# EAGLE design Tindog (EAGLE 5.11)
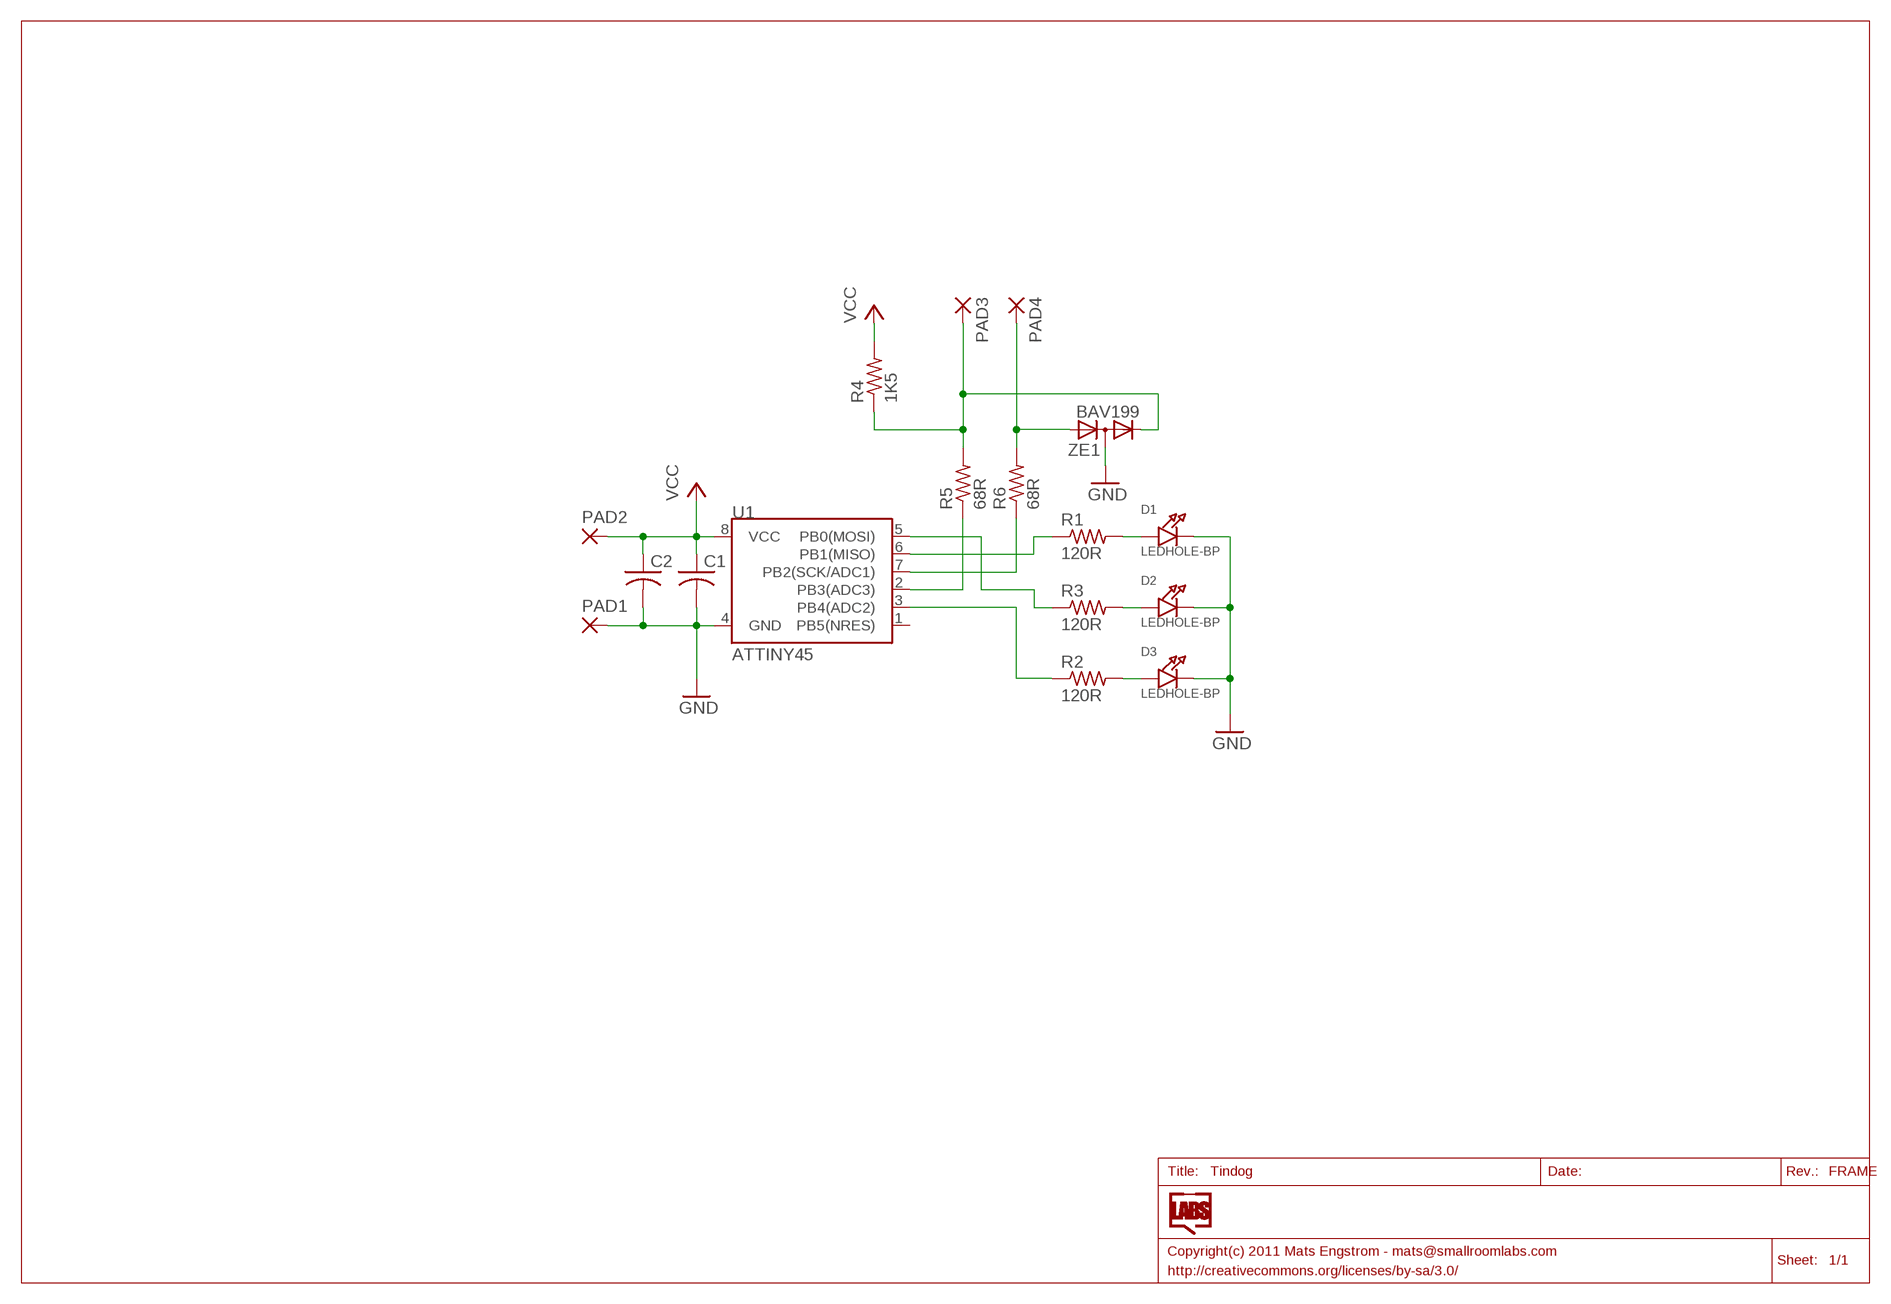
[diagram p0: schematic, sheet 1]

## Parts
C1  C-USC1206K  [C1206K]
C2  C-USC1206K  [C1206K]
D1  LEDHOLE-BP  [LED3MM-HOLE-BACKPAD]
D2  LEDHOLE-BP  [LED3MM-HOLE-BACKPAD]
D3  LEDHOLE-BP  [LED3MM-HOLE-BACKPAD]
PAD1  SMD5  [SMD2,54-5,08]
PAD2  SMD5  [SMD2,54-5,08]
PAD3  SMD5  [SMD2,54-5,08]
PAD4  SMD5  [SMD2,54-5,08]
R1  120R  R-US_R1206W  [R1206W]
R2  120R  R-US_R1206W  [R1206W]
R3  120R  R-US_R1206W  [R1206W]
R4  1K5  R-US_R1206W  [R1206W]
R5  68R  R-US_R1206W  [R1206W]
R6  68R  R-US_R1206W  [R1206W]
U1  ATTINY45  [SO08-EIAJ]
ZE1  BAV199  [SOT23]

## Nets
D+: PAD4.1(P) R6.2 ZE1.1(A)
D-: PAD3.1(P) R4.1 R5.2 ZE1.2(C)
GND: C1.2 C2.2 D1.C D2.C D3.C PAD1.1(P) U1.4(GND) ZE1.3(AC)
N$1: R3.1 U1.5(PB0(MOSI))
N$2: R1.1 U1.6(PB1(MISO))
N$3: D1.A R1.2
N$4: D2.A R3.2
N$5: D3.A R2.2
N$7: R2.1 U1.3(PB4(ADC2))
N$8: R5.1 U1.2(PB3(ADC3))
N$9: R6.1 U1.7(PB2(SCK/ADC1))
VCC: C1.1 C2.1 PAD2.1(P) R4.2 U1.8(VCC)
Unconnected: U1.1(PB5(NRES))

## Library data of the parts
C1 C2 = adafruit:C-US: CAPACITOR, American symbol
D1-D3 = SmallRoomLabs:LED
PAD1-PAD4 = wirepad:SMD5: SMD PAD
R1-R6 = adafruit:R-US_: RESISTOR, American symbol
U1 = SparkFun:ATTINY45: Atmel ATTiny45
ZE1 = diode:BAV199: DIODE low-leakage double diode

## Net classes
0 default: width 0.203 mm, drill 0.305 mm, clearance 0.203 mm

## Board
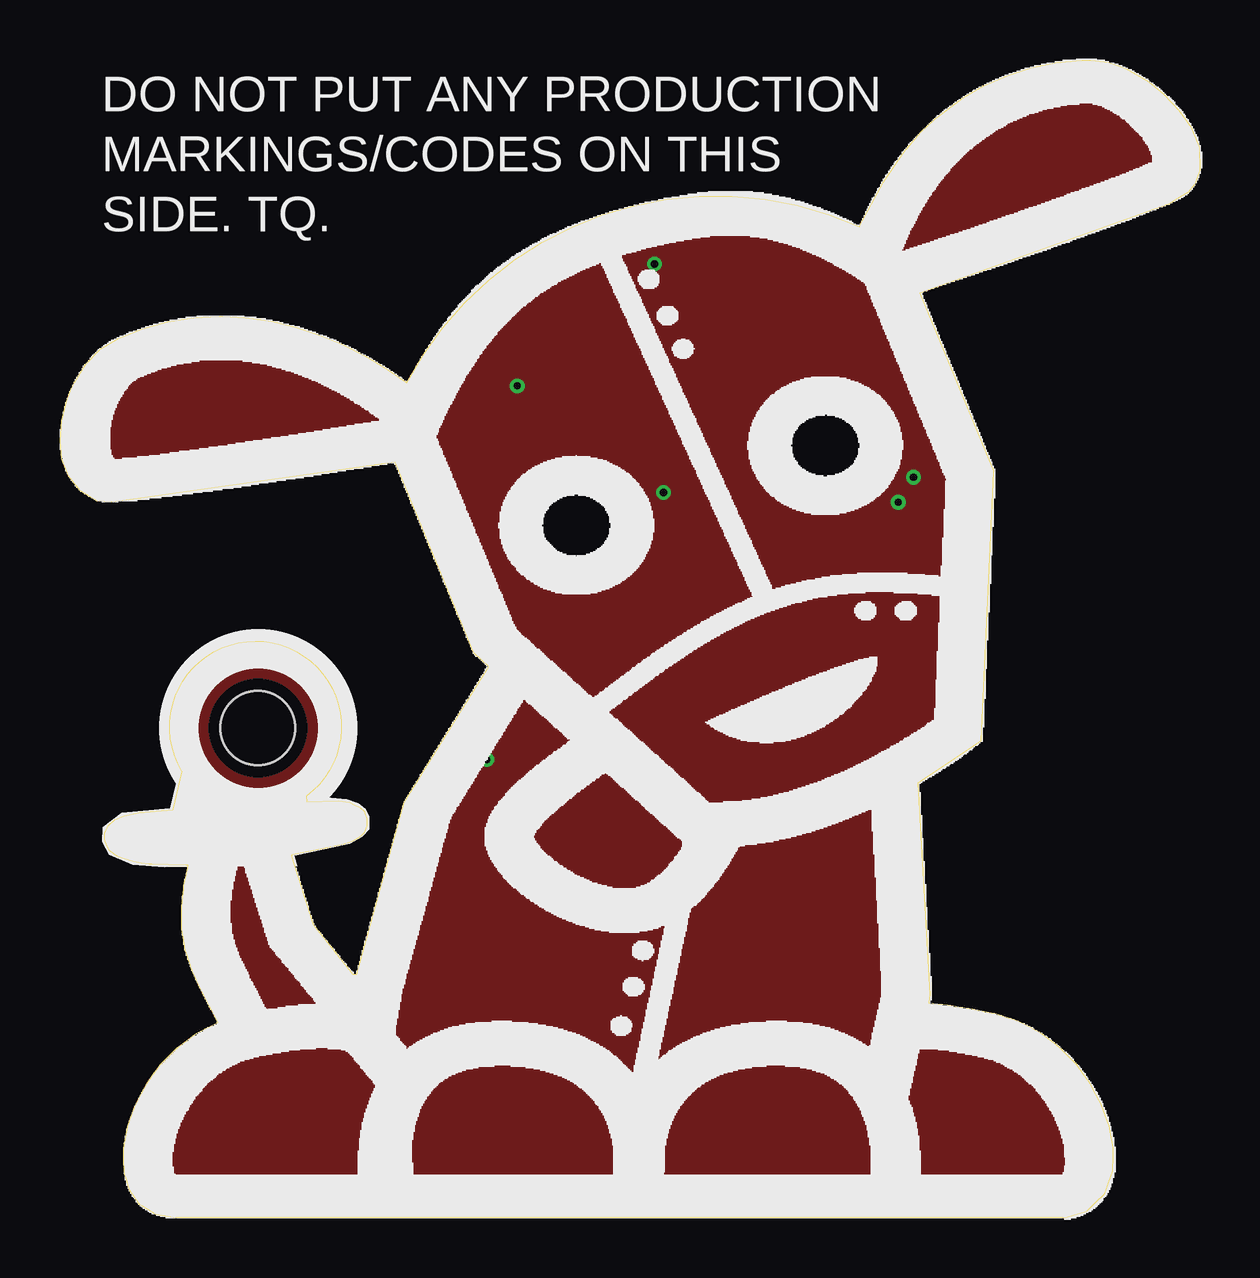
[diagram p1: board, top side]
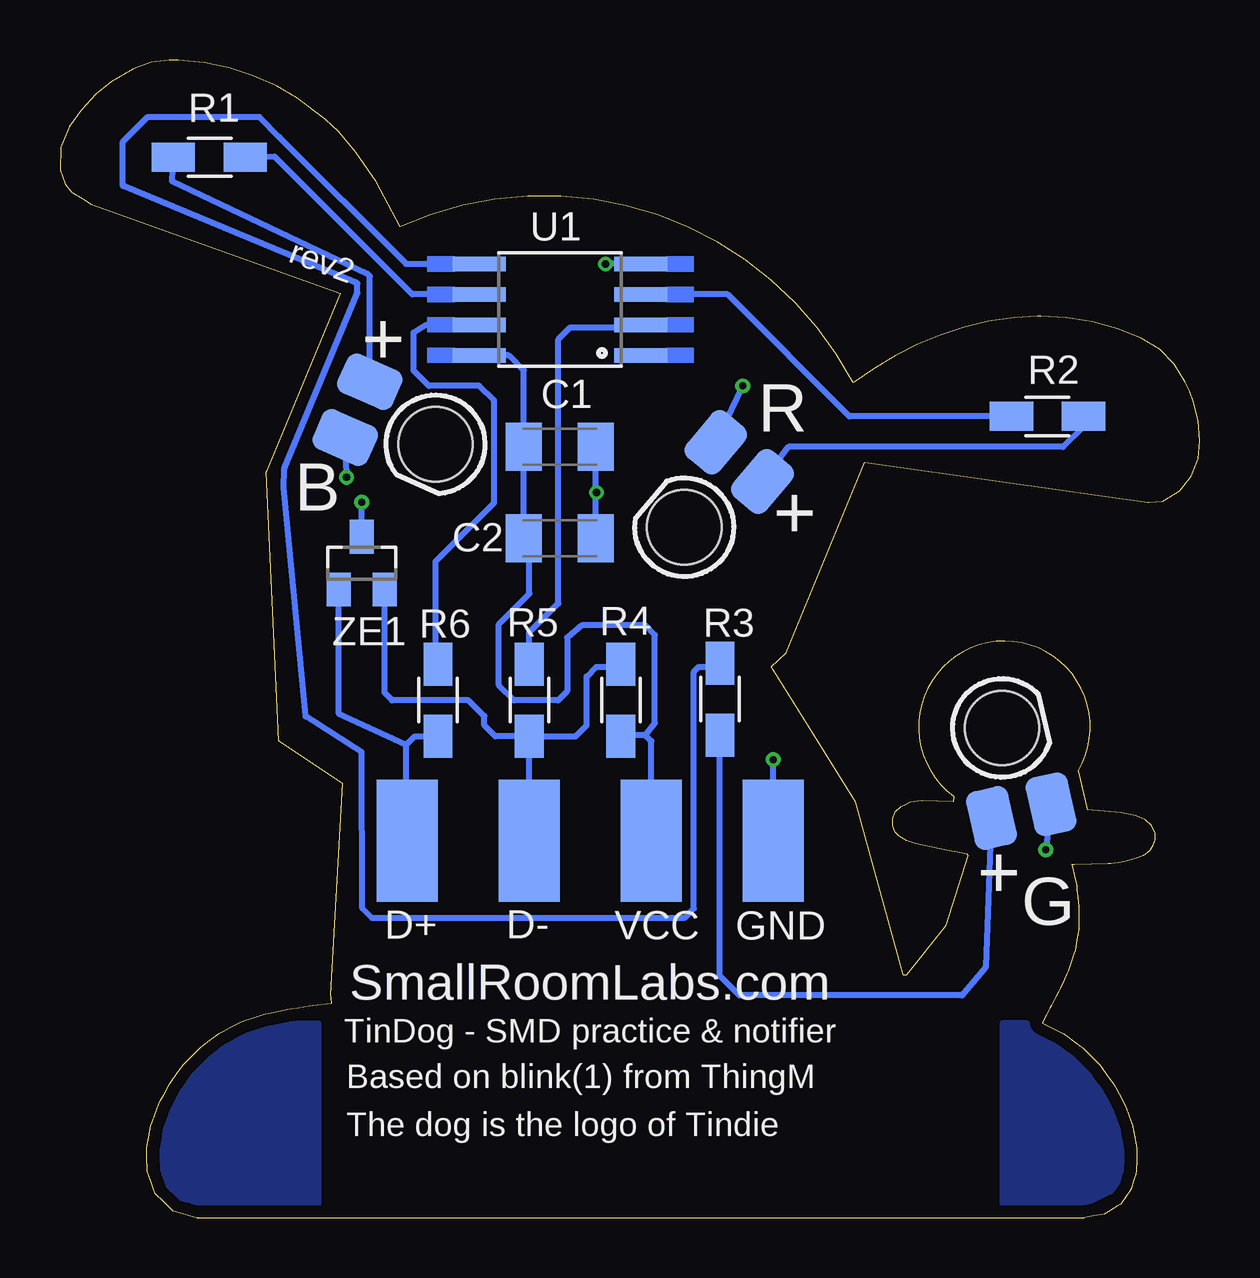
[diagram p2: board, bottom side, seen from below]

Size 47.5 x 48.25 mm. Coordinates in mm from the lower left corner, seen from the top.
Outline: 33.32,41.3 arc86 14.45,34.8 13.59,35.38 12.7,35.92 11.76,36.4 10.82,36.78 9.83,37.11 8.81,37.36 7.75,37.52 6.76,37.57 6.63,37.57 5.56,37.52 4.5,37.34 3.45,37.06 2.44,36.65 1.68,36.2 1.07,35.56 0.61,34.82 0.43,34.44 0.28,34.04 0.08,33.22 0,32.38 0.08,31.62 0.36,30.91 0.84,30.3 1.55,29.87 2.13,29.82 2.18,29.82 13.97,31.5 17.25,23.55 17.86,22.96 16.31,20.47 14.35,17.32 12.37,10.13 12.22,10.13 10.57,12.19 9.65,15.09 9.7,15.16 10.87,15.39 11.84,15.6 12.22,15.72 12.52,15.9 12.7,16.08 12.8,16.33 12.8,16.64 12.7,16.92 12.48,17.12 12.26,17.22 12.07,17.32 11.6,17.37 10.29,17.35 10.26,17.58 arc265 5.08,18.62 4.7,17.02 3.28,16.89 2.68,16.76 2.29,16.59 2.01,16.35 1.85,16.03 1.85,15.75 1.96,15.52 2.08,15.29 2.37,15.09 2.65,15 3.06,14.86 3.17,14.84 3.39,14.81 3.71,14.76 3.81,14.75 4.54,14.74 5.24,14.71 5.33,14.71 5.3,14.57 5.24,14.27 5.14,13.83 5.13,13.68 5.09,13.38 5.04,12.94 5.05,12.79 5.05,12.49 5.06,12.04 5.08,11.9 5.13,11.6 5.2,11.16 5.25,11.01 5.35,10.73 5.49,10.3 5.55,10.18 5.66,9.93 5.83,9.57 5.89,9.45 6.02,9.21 6.2,8.85 6.26,8.73 6.39,8.49 6.58,8.14 6.43,8.06 6.13,7.9 5.67,7.67 5.54,7.57 5.27,7.37 4.86,7.07 4.74,6.95 4.51,6.71 4.16,6.36 4.07,6.23 3.87,5.97 3.59,5.57 3.51,5.43 3.36,5.15 3.13,4.72 3.08,4.57 2.97,4.27 2.81,3.82 2.78,3.67 2.72,3.36 2.63,2.89 2.64,2.74 2.64,2.42 2.65,1.95 2.69,1.83 2.75,1.58 2.85,1.22 2.93,1.11 3.08,0.9 3.3,0.58 3.42,0.51 3.65,0.37 3.99,0.16 4.13,0.13 4.41,0.09 4.83,0 41.81,0 41.92,0.03 42.27,0.13 42.79,0.28 42.91,0.4 43.16,0.65 43.53,1.01 43.59,1.16 43.7,1.48 43.87,1.95 43.87,2.11 43.88,2.42 43.88,2.9 43.86,3.05 43.8,3.36 43.71,3.83 43.66,3.98 43.55,4.28 43.39,4.73 43.31,4.88 43.16,5.16 42.93,5.59 42.84,5.72 42.64,5.99 42.36,6.38 42.24,6.5 42.01,6.74 41.66,7.09 41.53,7.2 41.26,7.4 40.85,7.7 40.7,7.78 40.4,7.94 39.95,8.18 39.78,8.23 39.45,8.34 38.95,8.5 38.8,8.53 38.5,8.6 38.04,8.69 37.89,8.72 37.58,8.77 37.11,8.84 36.96,8.86 36.2,8.94 36.2,8.99 36.25,9.3 35.74,18.11 38.38,19.89 38.91,31.09 35.81,38.53 46.2,42.24 46.56,42.47 47,42.73 47.28,43.08 47.5,43.65 47.47,44.61 47.1,45.47 46.62,46.15 46,46.82 45.36,47.33 44.42,47.88 43.69,48.15 42.95,48.25 42.57,48.25 41.47,48.13 40.46,47.92 39.47,47.6 38.48,47.17 37.64,46.67 36.45,45.78 35.89,45.25 35.17,44.41 34.31,43.18 33.31,41.3
Copper layers (1*16): Top 0.035mm / dielectric 1.5mm / Bottom 0.035mm
Design rules "SmartPrototyping": minimum track width 7mil, minimum drill 12mil, track to track 7mil, track to pad 7mil, pad to pad 7mil, via to via 7mil, smd to smd 0mil, copper to edge 20mil, drill to drill 10mil, minimum pad ring 10mil, minimum via ring 6mil, stop-mask expansion 2mil, vias tented up to drill 25mil, thermal gap 10mil

### Footprints (pad centres in the part's own frame; a part is rotated, then mirrored left to right if it is on the bottom)
C1206K = smd 1.5 x 2: 1 -1.5,0; 2 1.5,0
LED3MM-HOLE-BACKPAD = smd 1.8 x 2.5 bottom: A -1.27,3.556; C 1.27,3.556 | hole 3.1: 0,0
SMD2,54-5,08 = smd 2.54 x 5.08: 1 0,0
R1206W = smd 1.8 x 1.2: 1 -1.499,0; 2 1.499,0
SO08-EIAJ = smd 0.61 x 2.21: 1 -1.905,-3.378; 2 -0.635,-3.378; 3 0.635,-3.378; 4 1.905,-3.378; 5 1.905,3.353; 6 0.635,3.353; 7 -0.635,3.353; 8 -1.905,3.353
SOT23 = smd 1 x 1.4: 1 -0.95,-1.1; 2 0.95,-1.1; 3 0,1.1

### Placement (x,y rotation side)
C1  26.67,32.13 0 bottom
C2  26.67,28.32 0 bottom
D1  31.85,32.23 294 top
D2  8.25,20.42 167 top
D3  21.49,28.78 40 top
PAD1  17.78,15.72 0 bottom
PAD2  22.86,15.72 0 bottom
PAD3  27.94,15.72 0 bottom
PAD4  33.02,15.72 0 bottom
R1  41.27,44.2 180 bottom
R2  6.35,33.4 0 bottom
R3  20,21.61 270 bottom
R4  24.13,21.57 270 bottom
R5  27.94,21.57 270 bottom
R6  31.75,21.57 270 bottom
U1  26.67,37.85 90 bottom
ZE1  34.92,27.28 0 bottom

### Tracks (layer width: path | path; a pad name or v marks a point on that pad's centre or on a via)
D+
  Bottom 0.254: R6.2 32.72,20.07 33.07,19.71 | 33.07,19.71 33.07,15.77 PAD4.1 | ZE1.1 35.88,21.02 33.07,19.71
D-
  Bottom 0.254: PAD3.1 R5.2 | R5.2 29.36,20.07 29.82,20.53 29.82,20.91 30.48,21.57 33.65,21.57 33.97,21.89 ZE1.2 | R5.2 26.01,20.07 25.55,20.53 25.55,22.56 25.15,22.96 24.23,22.96 R4.1
GND  (via drill 0.3)
  Bottom 0.254: U1.4 v24.77,39.75 | D1.C 35.56,30.96 v35.56,30.86 | ZE1.3 v34.92,29.82 | C2.2 25.17,30.2 v25.15,30.23 25.17,30.25 C1.2 | PAD1.1 v17.78,19.09 | D2.C 6.4,15.47 v6.43,15.34 | D3.C v19.05,34.67
  pour Top: -0.27,0.11 47.73,0.11 47.73,48.11 -0.27,48.11
N$1
  Bottom 0.203: 20.15,22.96 R3.1 | 34.49,12.49 34.9,12.9
  Bottom 0.254: U1.5 33.08,39.75 38.35,45.03 39.19,45.87 43.84,45.87 44.88,44.83 44.88,43 35.1,38.94 35.1,38.53 38.15,31.22 38.18,30.42 37.26,20.9 34.93,19.41 34.9,12.9 | 20.15,22.96 20.88,22.96 21.08,22.76 21.08,12.9 21.49,12.49 34.49,12.49
N$2
  Bottom 0.254: U1.6 32.82,38.48 38.56,44.22 R1.1
N$3
  Bottom 0.254: D1.A 34.58,39.23 34.7,39.34 42.82,43.2 R1.2
N$4
  Bottom 0.254: R3.2 20,10.08 19.19,9.27 9.91,9.27 8.9,10.48 D2.A
N$5
  Bottom 0.254: R2.2 4.85,32.99 5.71,32.13 17.14,32.13 D3.A
N$6
  pour Bottom: 4.73,0.61 3.73,1.11 3.23,1.61 3.23,3.61 4.23,5.61 5.73,7.11 7.23,8.11 8.23,8.11 8.23,0.61
N$7
  Bottom 0.254: R2.1 14.61,33.4 19.68,38.48 U1.3
N$8
  Bottom 0.254: 23.19,37.11 U1.2 23.39,37.11 26.23,37.11 26.73,36.61 26.73,25.61 27.94,24.4 R5.1
N$9
  Bottom 0.254: U1.7 32.26,37.21 32.77,36.89 32.77,35.31 32.13,34.67 30.02,34.67 29.41,34.06 29.41,29.79 31.85,27.36 31.85,23.17 R6.1
N$10
  pour Bottom: 36.73,0.61 42.23,0.61 43.23,1.61 43.23,3.61 42.73,4.61 42.23,5.61 40.73,7.11 38.73,8.11 36.73,8.11
VCC
  Bottom 0.254: U1.8 28.8,35.94 28.17,35.31 C1.1 C2.1 27.94,28.09 27.94,26.01 29.21,24.74 29.21,22.2 28.57,21.57 26.75,21.57 26.37,21.95 26.37,24.18 25.76,24.69 23.12,24.69 22.71,24.28 22.71,20.62 23.11,20.12 | PAD2.1 22.86,19.86 23.11,20.12 | 23.11,20.12 24.08,20.12 R4.2
(copper drawn outside any net)
  shapes: Bottom area x8

### Text on the board
tPlace: DO NOT PUT ANY PRODUCTION | MARKINGS/CODES ON THIS | SIDE. TQ.
bPlace: rev2 | + | R | B | + | + | G | D- | D+ | GND | VCC | SmallRoomLabs.com | TinDog - SMD practice & notifier | Based on blink(1) from ThingM | The dog is the logo of Tindie